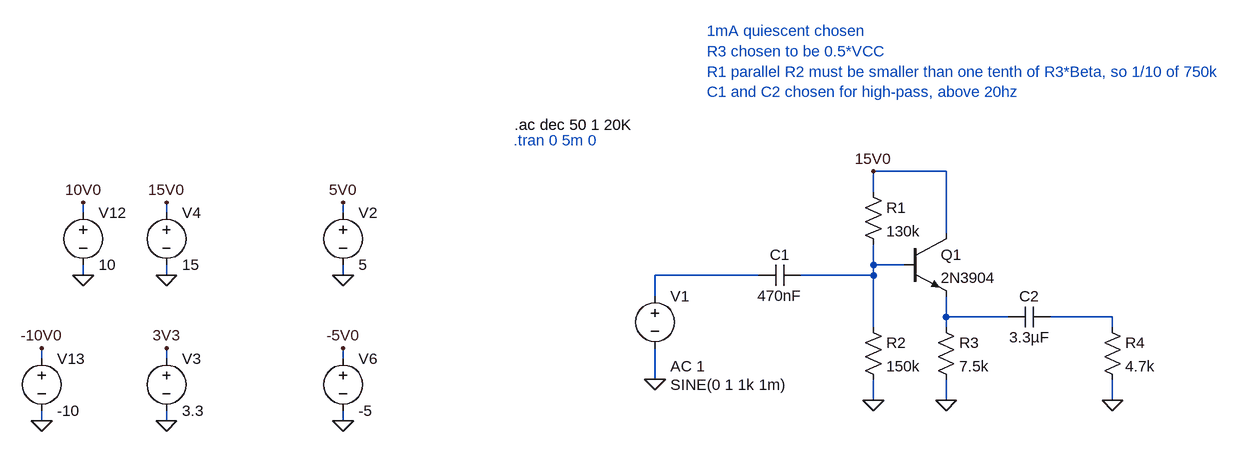
[diagram p0: schematic amp_bias_example.asc]
amp_bias_example.asc, the LTspice schematic file:
Version 4
SHEET 1 4136 1636
WIRE 592 320 480 320
WIRE 480 352 480 320
WIRE -736 384 -736 368
WIRE -608 384 -608 368
WIRE -336 384 -336 368
WIRE 592 416 592 320
WIRE 480 464 480 432
WIRE 528 464 480 464
WIRE -736 480 -736 464
WIRE -608 480 -608 464
WIRE -336 480 -336 464
WIRE 304 480 144 480
WIRE 480 480 480 464
WIRE 480 480 368 480
WIRE 144 512 144 480
WIRE 592 544 592 512
WIRE 688 544 592 544
WIRE 848 544 752 544
WIRE 480 560 480 480
WIRE 592 560 592 544
WIRE 848 560 848 544
WIRE -800 608 -800 592
WIRE -608 608 -608 592
WIRE -336 608 -336 592
WIRE 144 640 144 592
WIRE 480 672 480 640
WIRE 592 672 592 640
WIRE 848 672 848 640
WIRE -800 704 -800 688
WIRE -608 704 -608 688
WIRE -336 704 -336 688
FLAG -336 480 0
FLAG -336 368 5V0
FLAG -608 480 0
FLAG -608 368 15V0
FLAG -336 704 0
FLAG -336 592 -5V0
FLAG -608 704 0
FLAG -608 592 3V3
FLAG -736 480 0
FLAG -736 368 10V0
FLAG -800 704 0
FLAG -800 592 -10V0
FLAG 144 640 0
FLAG 480 672 0
FLAG 480 320 15V0
FLAG 592 672 0
FLAG 848 672 0
SYMBOL voltage -336 368 R0
WINDOW 123 0 0 Left 0
WINDOW 39 0 0 Left 0
SYMATTR InstName V2
SYMATTR Value 5
SYMBOL voltage -608 368 R0
WINDOW 123 0 0 Left 0
WINDOW 39 0 0 Left 0
SYMATTR InstName V4
SYMATTR Value 15
SYMBOL voltage -336 592 R0
WINDOW 123 0 0 Left 0
WINDOW 39 0 0 Left 0
SYMATTR InstName V6
SYMATTR Value -5
SYMBOL voltage -608 592 R0
WINDOW 123 0 0 Left 0
WINDOW 39 0 0 Left 0
SYMATTR InstName V3
SYMATTR Value 3.3
SYMBOL voltage -736 368 R0
WINDOW 123 0 0 Left 0
WINDOW 39 0 0 Left 0
SYMATTR InstName V12
SYMATTR Value 10
SYMBOL voltage -800 592 R0
WINDOW 123 0 0 Left 0
WINDOW 39 0 0 Left 0
SYMATTR InstName V13
SYMATTR Value -10
SYMBOL cap 368 464 R90
WINDOW 0 0 32 VBottom 2
WINDOW 3 32 32 VTop 2
SYMATTR InstName C1
SYMATTR Value 470nF
SYMBOL voltage 144 496 R0
WINDOW 3 24 152 Left 2
WINDOW 123 24 124 Left 2
WINDOW 39 0 0 Left 0
SYMATTR InstName V1
SYMATTR Value SINE(0 1 1k 1m)
SYMATTR Value2 AC 1
SYMBOL res 464 336 R0
SYMATTR InstName R1
SYMATTR Value 130k
SYMBOL res 464 544 R0
SYMATTR InstName R2
SYMATTR Value 150k
SYMBOL npn 528 416 R0
SYMATTR InstName Q1
SYMATTR Value 2N3904
SYMBOL res 576 544 R0
SYMATTR InstName R3
SYMATTR Value 7.5k
SYMBOL cap 688 528 M90
WINDOW 0 0 32 VBottom 2
WINDOW 3 32 32 VTop 2
SYMATTR InstName C2
SYMATTR Value 3.3µF
SYMBOL res 832 544 R0
SYMATTR InstName R4
SYMATTR Value 4.7k
TEXT -72 248 Left 2 !.ac dec 50 1 20K
TEXT -74 272 Left 2 ;.tran 0 5m 0
TEXT 224 104 Left 2 ;1mA quiescent chosen\nR3 chosen to be 0.5*VCC\nR1 parallel R2 must be smaller than one tenth of R3*Beta, so 1/10 of 750k\nC1 and C2 chosen for high-pass, above 20hz

The netlist it stands for:
* amp_bias_example.asc
V2 5V0 0 5
V4 15V0 0 15
V6 -5V0 0 -5
V3 3V3 0 3.3
V12 10V0 0 10
V13 -10V0 0 -10
C1 N001 N002 470nF
V1 N002 0 SINE(0 1 1k 1m) AC 1
R1 15V0 N001 130k
R2 N001 0 150k
Q1 15V0 N001 N003 0 2N3904
R3 N003 0 7.5k
C2 N003 N004 3.3µF
R4 N004 0 4.7k
.model NPN NPN
.model PNP PNP
.lib standard.bjt
.ac dec 50 1 20K
* .tran 0 5m 0
* 1mA quiescent chosen
* R3 chosen to be 0.5*VCC
* R1 parallel R2 must be smaller than one tenth of R3*Beta, so 1/10 of 750k
* C1 and C2 chosen for high-pass, above 20hz
.backanno
.end